# EAGLE schematic mcu_rev2_full (EAGLE 9.5.0)

## Sheet 1 of 2
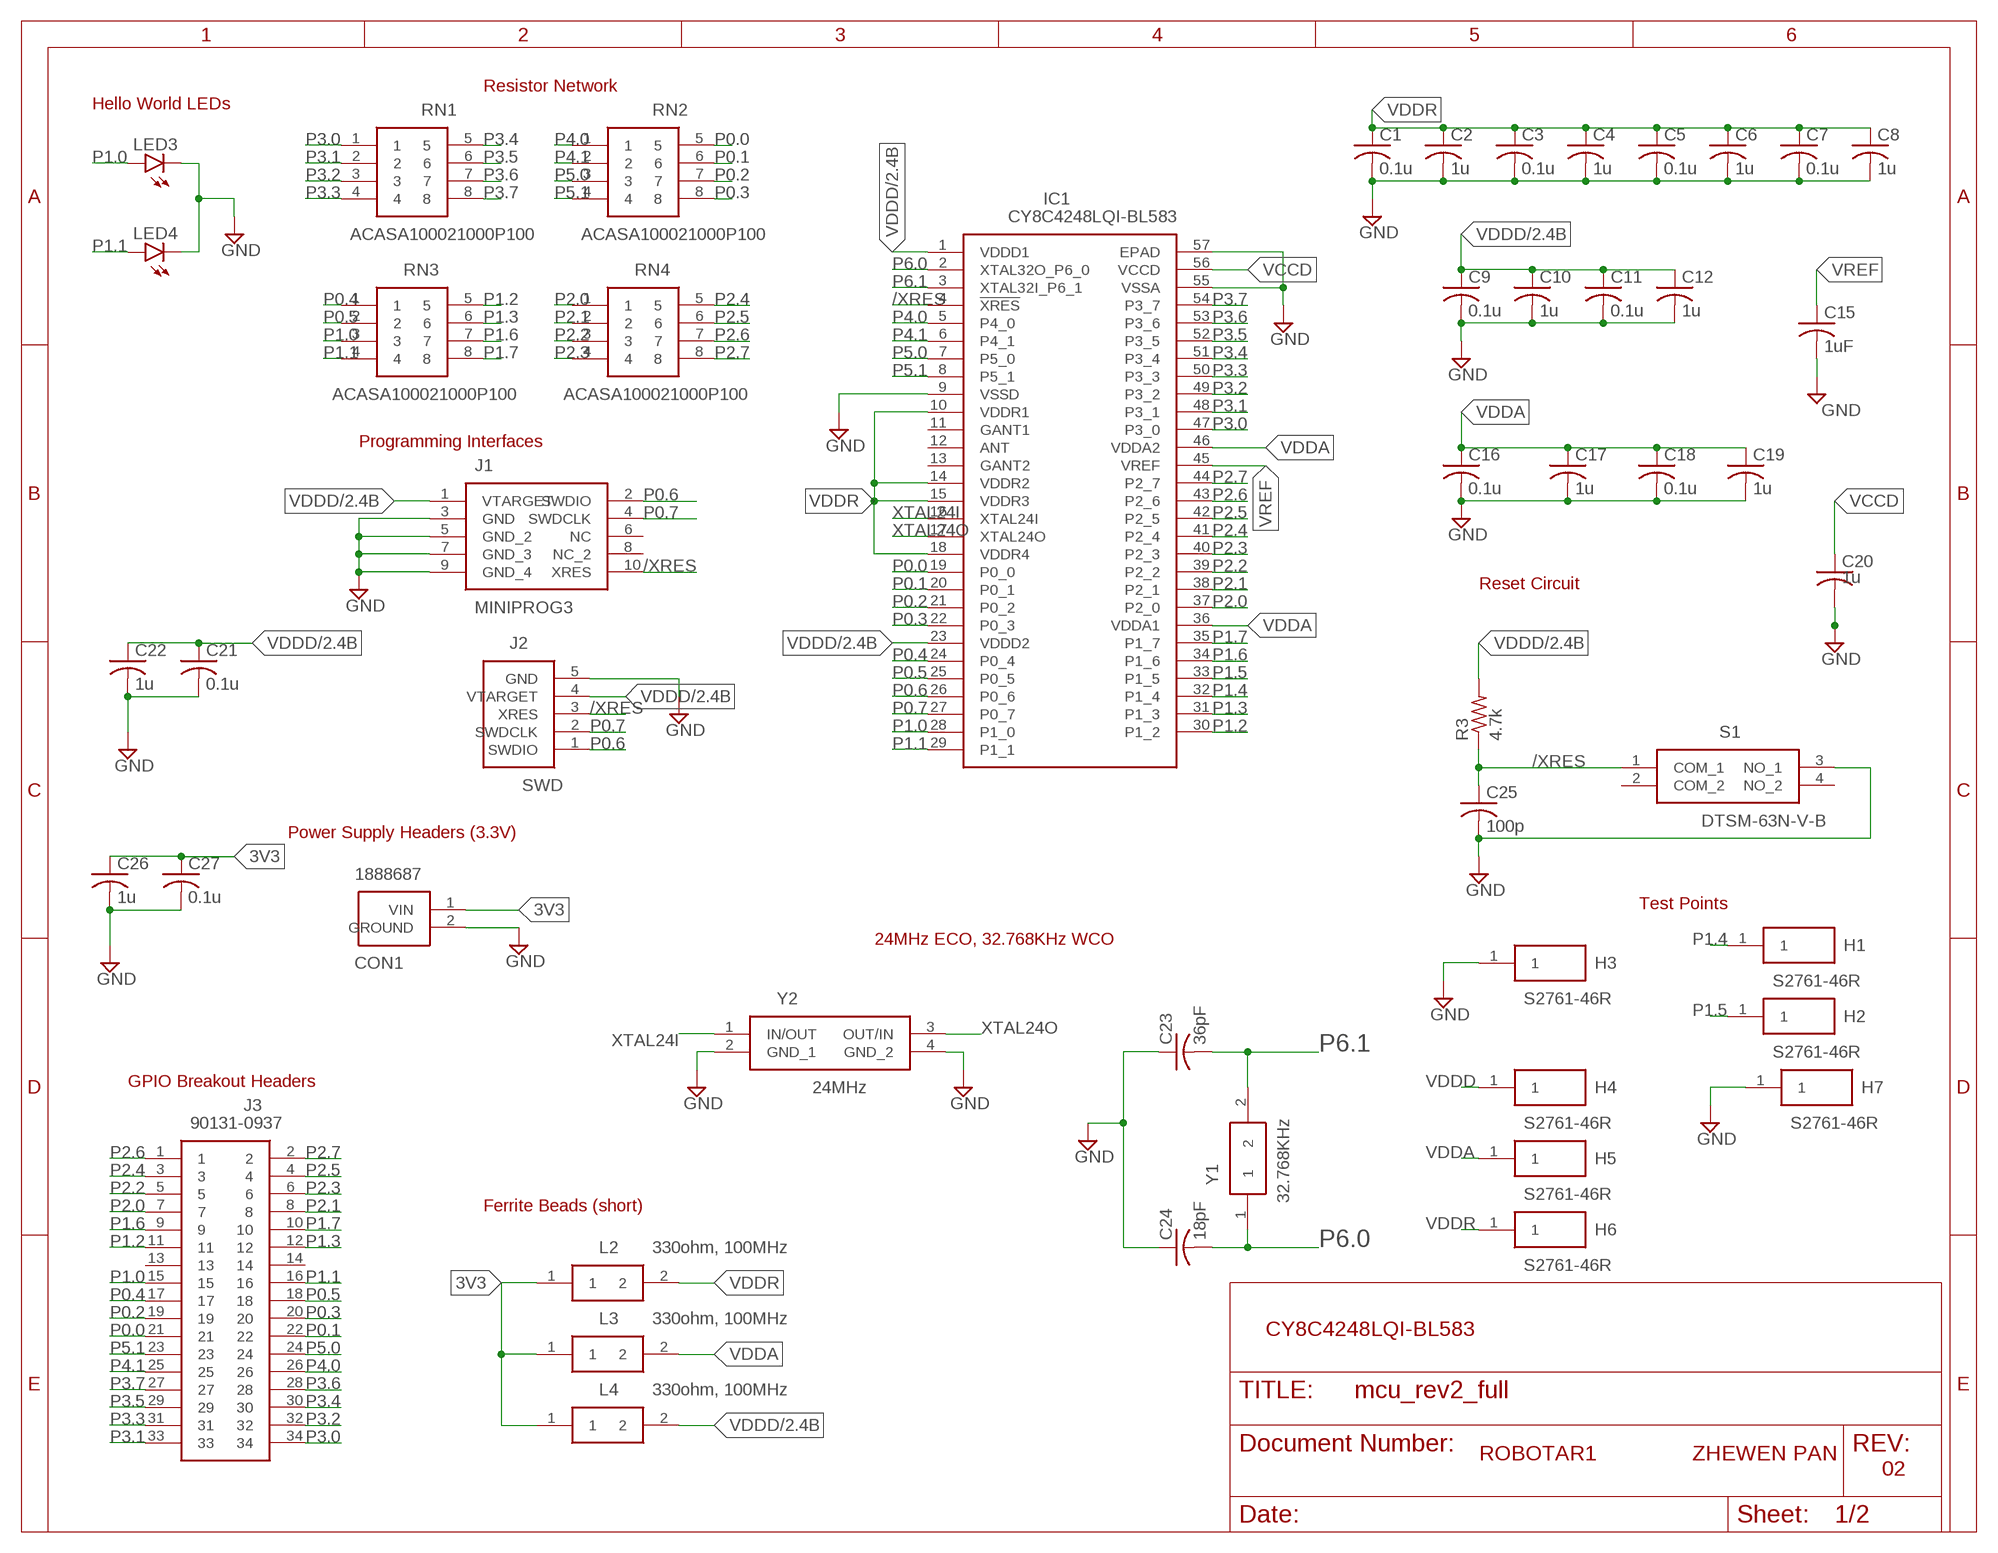
[diagram p0: schematic, sheet 1]

### Parts
C1  0.1u  C-USC0805  [C0805]
C2  1u  C-USC0805  [C0805]
C3  0.1u  C-USC0805  [C0805]
C4  1u  C-USC0805  [C0805]
C5  0.1u  C-USC0805  [C0805]
C6  1u  C-USC0805  [C0805]
C7  0.1u  C-USC0805  [C0805]
C8  1u  C-USC0805  [C0805]
C9  0.1u  C-USC0805  [C0805]
C10  1u  C-USC0805  [C0805]
C11  0.1u  C-USC0805  [C0805]
C12  1u  C-USC0805  [C0805]
C15  1uF  C-USC0805  [C0805]
C16  0.1u  C-USC0805  [C0805]
C17  1u  C-USC0805  [C0805]
C18  0.1u  C-USC0805  [C0805]
C19  1u  C-USC0805  [C0805]
C20  1u  C-USC0805  [C0805]
C21  0.1u  C-USC0805  [C0805]
C22  1u  C-USC0805  [C0805]
C23  36pF  C-USC0805  [C0805]
C24  18pF  C-USC0805  [C0805]
C25  100p  C-USC0805  [C0805]
C26  1u  C-USC0805  [C0805]
C27  0.1u  C-USC0805  [C0805]
CON1  1888687  [SHDR2W90P0X508_1X2_1016X950X15]
H1  S2761-46R  [S276146R]
H2  S2761-46R  [S276146R]
H3  S2761-46R  [S276146R]
H4  S2761-46R  [S276146R]
H5  S2761-46R  [S276146R]
H6  S2761-46R  [S276146R]
H7  S2761-46R  [S276146R]
IC1  CY8C4248LQI-BL583  [QFN40P700X700X60-57N]
J1  MINIPROG3  FTSH-105-01-L-DV-K  [FTSH-105-01-L-DV-K]
J2  SWD  22-23-2051  [HDRV5W64P0X254_1X5_1255X635X81]
J3  90131-0937  [HDRV34W90P254_2X17_4308X500X56]
L2  330ohm, 100MHz  BLM21PG331SN1D  [BEADC2012X105N]
L3  330ohm, 100MHz  BLM21PG331SN1D  [BEADC2012X105N]
L4  330ohm, 100MHz  BLM21PG331SN1D  [BEADC2012X105N]
LED3  LEDSML0805  [SML0805]
LED4  LEDSML0805  [SML0805]
R3  4.7k  R-US_R0805  [R0805]
RN1  ACASA100021000P100  [ACASA100021000P100]
RN2  ACASA100021000P100  [ACASA100021000P100]
RN3  ACASA100021000P100  [ACASA100021000P100]
RN4  ACASA100021000P100  [ACASA100021000P100]
S1  DTSM-63N-V-B  [DTSM63NVB]
Y1  32.768KHz  ECS-.327-12.5-34B-TR  [ECX-31B]
Y2  24MHz  ECS-240-8-36CKM-TR  [ECS240836QAESTR]

### Nets
3V3: C26.1 C27.1 CON1.1(VIN) L2.1 L3.1 L4.1
/XRES: C25.1 IC1.4(!XRES) J1.10(XRES) J2.3(XRES) R3.1 S1.1(COM_1)
GND: C1.2 C2.2 C3.2 C4.2 C5.2 C6.2 C7.2 C8.2 C9.2 C10.2 C11.2 C12.2 C15.2 C16.2 C17.2 C18.2 C19.2 C20.2 C21.2 C22.2 C23.1 C24.1 C25.2 C26.2 C27.2 CON1.2(GROUND) H3.1 H7.1 IC1.9(VSSD) IC1.55(VSSA) IC1.57(EPAD) J1.3(GND) J1.5(GND_2) J1.7(GND_3) J1.9(GND_4) J2.5(GND) LED3.C LED4.C S1.3(NO_1) Y2.2(GND_1) Y2.4(GND_2) ; also sheet 2
P0.0: IC1.19(P0_0) J3.21 RN2.5
P0.1: IC1.20(P0_1) J3.22 RN2.6
P0.2: IC1.21(P0_2) J3.19 RN2.7
P0.3: IC1.22(P0_3) J3.20 RN2.8
P0.4: IC1.24(P0_4) J3.17 RN3.1
P0.5: IC1.25(P0_5) J3.18 RN3.2
P0.6: IC1.26(P0_6) J1.2(SWDIO) J2.1(SWDIO)
P0.7: IC1.27(P0_7) J1.4(SWDCLK) J2.2(SWDCLK)
P1.0: IC1.28(P1_0) J3.15 LED3.A RN3.3
P1.1: IC1.29(P1_1) J3.16 LED4.A RN3.4
P1.2: IC1.30(P1_2) J3.11 RN3.5
P1.3: IC1.31(P1_3) J3.12 RN3.6
P1.4: H1.1 IC1.32(P1_4) ; also sheet 2
P1.5: H2.1 IC1.33(P1_5) ; also sheet 2
P1.6: IC1.34(P1_6) J3.9 RN3.7 ; also sheet 2
P1.7: IC1.35(P1_7) J3.10 RN3.8
P2.0: IC1.37(P2_0) J3.7 RN4.1
P2.1: IC1.38(P2_1) J3.8 RN4.2
P2.2: IC1.39(P2_2) J3.5 RN4.3
P2.3: IC1.40(P2_3) J3.6 RN4.4
P2.4: IC1.41(P2_4) J3.3 RN4.5
P2.5: IC1.42(P2_5) J3.4 RN4.6
P2.6: IC1.43(P2_6) J3.1 RN4.7
P2.7: IC1.44(P2_7) J3.2 RN4.8
P3.0: IC1.47(P3_0) J3.34 RN1.1
P3.1: IC1.48(P3_1) J3.33 RN1.2
P3.2: IC1.49(P3_2) J3.32 RN1.3
P3.3: IC1.50(P3_3) J3.31 RN1.4
P3.4: IC1.51(P3_4) J3.30 RN1.5
P3.5: IC1.52(P3_5) J3.29 RN1.6
P3.6: IC1.53(P3_6) J3.28 RN1.7
P3.7: IC1.54(P3_7) J3.27 RN1.8
P4.0: IC1.5(P4_0) J3.26 RN2.1
P4.1: IC1.6(P4_1) J3.25 RN2.2
P5.0: IC1.7(P5_0) J3.24 RN2.3
P5.1: IC1.8(P5_1) J3.23 RN2.4
P6.0: C24.2 IC1.2(XTAL32O_P6_0) Y1.1
P6.1: C23.2 IC1.3(XTAL32I_P6_1) Y1.2
VCCD: C20.1 IC1.56(VCCD)
VDDA: C16.1 C17.1 C18.1 C19.1 H5.1 IC1.36(VDDA1) IC1.46(VDDA2) L3.2
VDDD: C9.1 C10.1 C11.1 C12.1 C21.1 C22.1 H4.1 IC1.1(VDDD1) IC1.23(VDDD2) J1.1(VTARGET) J2.4(VTARGET) L4.2 R3.2 ; also sheet 2
VDDR: C1.1 C2.1 C3.1 C4.1 C5.1 C6.1 C7.1 C8.1 H6.1 IC1.10(VDDR1) IC1.14(VDDR2) IC1.15(VDDR3) IC1.18(VDDR4) L2.2
VREF: C15.1 IC1.45(VREF)
XTAL24I: IC1.16(XTAL24I) Y2.1(IN/OUT)
XTAL24O: IC1.17(XTAL24O) Y2.3(OUT/IN)
Unconnected: IC1.11(GANT1) IC1.12(ANT) IC1.13(GANT2) J1.6(NC) J1.8(NC_2) J3.13 J3.14 S1.2(COM_2) S1.4(NO_2)

### Notes on the sheet
- Resistor Network
- Hello World LEDs
- Programming Interfaces
- Reset Circuit
- Power Supply Headers (3.3V)
- Test Points
- 24MHz ECO, 32.768KHz WCO
- GPIO Breakout Headers
- Ferrite Beads (short)
- CY8C4248LQI-BL583
- ROBOTAR1 | ZHEWEN PAN | 02

## Sheet 2 of 2
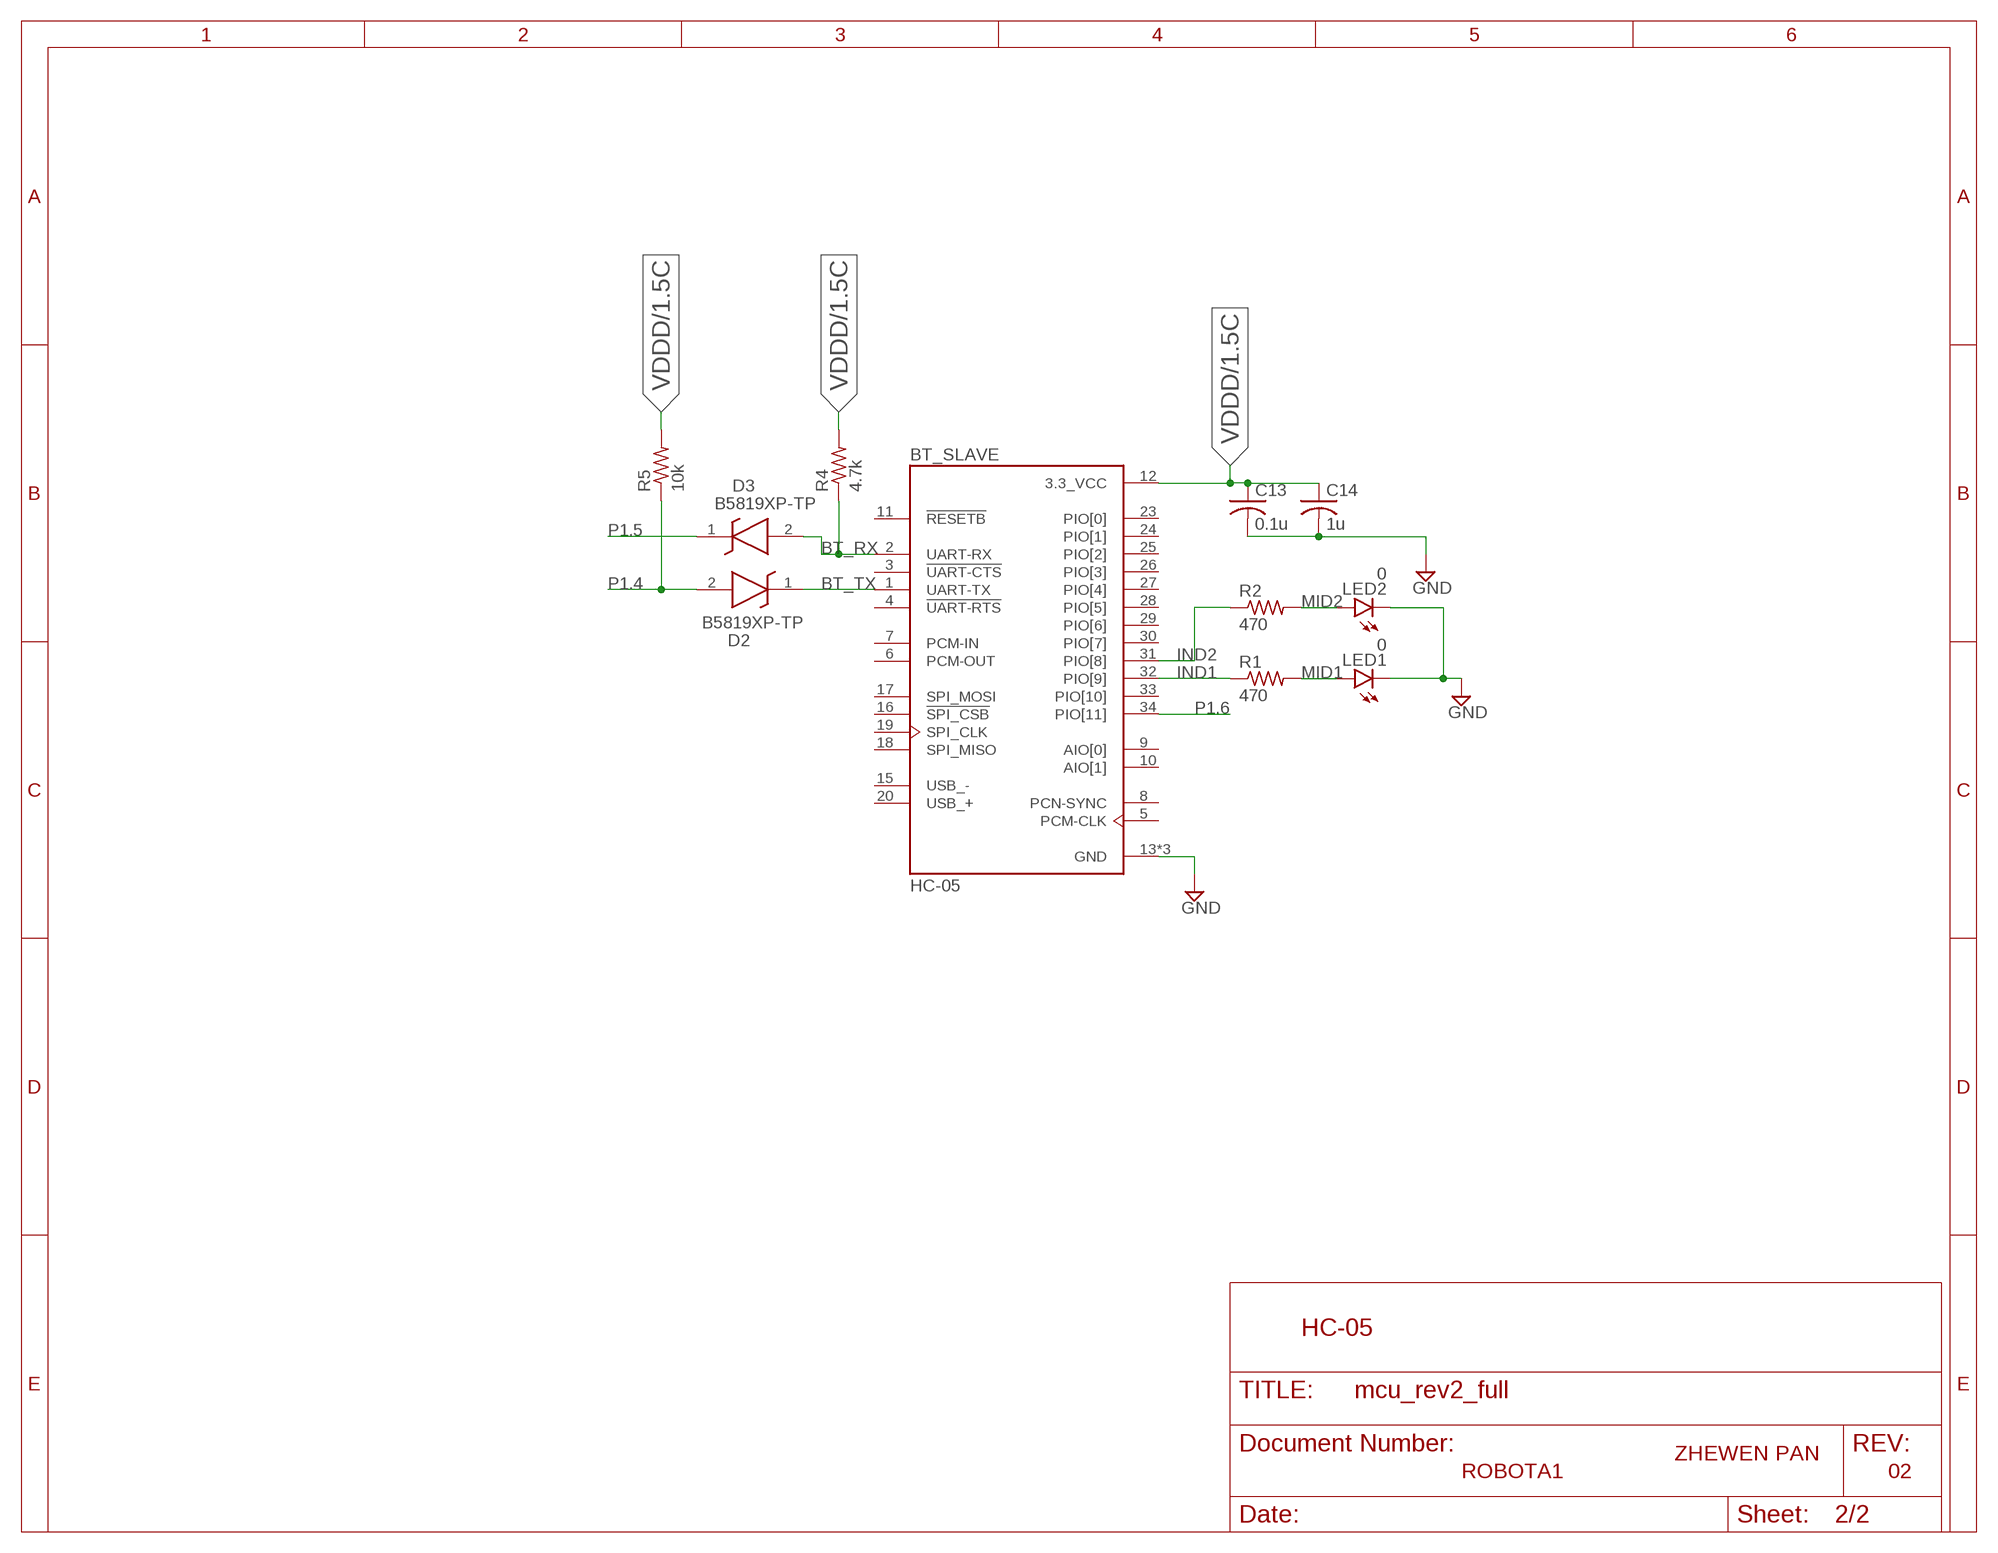
[diagram p1: schematic, sheet 2]

### Parts
BT_SLAVE  HC-05  [XCVR_HC-05]
C13  0.1u  C-USC0805  [C0805]
C14  1u  C-USC0805  [C0805]
D2  B5819XP-TP  [B5819XPTP]
D3  B5819XP-TP  [B5819XPTP]
LED1  0  LEDSML0805  [SML0805]
LED2  0  LEDSML0805  [SML0805]
R1  470  R-US_R0805  [R0805]
R2  470  R-US_R0805  [R0805]
R4  4.7k  R-US_R0805  [R0805]
R5  10k  R-US_R0805  [R0805]

### Nets
BT_RX: BT_SLAVE.2(UART-RX) D3.2(+) R4.1
BT_TX: BT_SLAVE.1(UART-TX) D2.1(-)
GND: BT_SLAVE.13(GND) BT_SLAVE.21(GND) BT_SLAVE.22(GND) C13.2 C14.2 LED1.C LED2.C ; also sheet 1
IND1: BT_SLAVE.32(PIO[9]) R1.1
IND2: BT_SLAVE.31(PIO[8]) R2.1
MID1: LED1.A R1.2
MID2: LED2.A R2.2
P1.4: D2.2(+) R5.1 ; also sheet 1
P1.5: D3.1(-) ; also sheet 1
P1.6: BT_SLAVE.34(PIO[11]) ; also sheet 1
VDDD: BT_SLAVE.12(3.3_VCC) C13.1 C14.1 R4.2 R5.2 ; also sheet 1
Unconnected: BT_SLAVE.3(!UART-CTS) BT_SLAVE.4(!UART-RTS) BT_SLAVE.5(PCM-CLK) BT_SLAVE.6(PCM-OUT) BT_SLAVE.7(PCM-IN) BT_SLAVE.8(PCN-SYNC) BT_SLAVE.9(AIO[0]) BT_SLAVE.10(AIO[1]) BT_SLAVE.11(!RESETB) BT_SLAVE.15(USB_-) BT_SLAVE.16(!SPI_CSB) BT_SLAVE.17(SPI_MOSI) BT_SLAVE.18(SPI_MISO) BT_SLAVE.19(SPI_CLK) BT_SLAVE.20(USB_+) BT_SLAVE.23(PIO[0]) BT_SLAVE.24(PIO[1]) BT_SLAVE.25(PIO[2]) BT_SLAVE.26(PIO[3]) BT_SLAVE.27(PIO[4]) BT_SLAVE.28(PIO[5]) BT_SLAVE.29(PIO[6]) BT_SLAVE.30(PIO[7]) BT_SLAVE.33(PIO[10])

### Notes on the sheet
- HC-05
- ZHEWEN PAN
- ROBOTA1 | 02

## Library data of the parts
BT_SLAVE = HC-05:HC-05: Bluetooth to Serial Port Module; AVAILABILITY: Unavailable; MF: Texas Instruments; MP: HC-05; PACKAGE: SOIC-14; PRICE: None; SPICEPREFIX: X
C1-C27 = rcl:C-US: CAPACITOR, American symbol; SPICEPREFIX: C
CON1 = SamacSys_Parts:1888687: Phoenix Contact COMBICON MKDSN Series 5.08mm Pitch Straight PCB Terminal Block with Screw Termination, Through Hole Source: Datasheet <http://uk.rs-online.com/web/p/products/8045095>; ALLIED_NUMBER: 70054422; DESCRIPTION: Phoenix Contact COMBICON MKDSN Series 5.08mm Pitch Straight PCB Terminal Block with Screw Termination, Through Hole; HEIGHT: 15mm; MANUFACTURER_NAME: Phoenix Contact; MANUFACTURER_PART_NUMBER: 1888687; RS_PART_NUMBER: 8045095; RS_PRICE-STOCK: http://uk.rs-online.com/web/p/products/8045095
D2 D3 = SamacSys_Parts:B5819XP-TP: Schottky Diodes & Rectifiers 1A,40V,Schottky,FBP-02L Package Source: Datasheet <http://www.mccsemi.com/up_pdf/B5819XP(FBP-02L)-B.pdf>; DESCRIPTION: Schottky Diodes & Rectifiers 1A,40V,Schottky,FBP-02L Package; HEIGHT: 0.55mm; MANUFACTURER_NAME: Micro Commercial Components (MCC); MANUFACTURER_PART_NUMBER: B5819XP-TP
H1-H7 = S2761-46R:S2761-46R: Circuit Board Hardware - PCB SMT Mini Test Terminal, Reel Source: Datasheet <https://cdn.harwin.com/pdfs/S2761R.pdf>; DESCRIPTION: Circuit Board Hardware - PCB SMT Mini Test Terminal, Reel; HEIGHT: 1.15mm; MANUFACTURER_NAME: HARWIN; MANUFACTURER_PART_NUMBER: S2761-46R
IC1 = CY8C4248LQI-BL583:CY8C4248LQI-BL583: PSoC 4xx8_BLE Source: Datasheet <http://uk.rs-online.com/web/p/products/1771220P>; DESCRIPTION: PSoC 4xx8_BLE; HEIGHT: mm; MANUFACTURER_NAME: Cypress Semiconductor; MANUFACTURER_PART_NUMBER: CY8C4248LQI-BL583; RS_PART_NUMBER: 1771220P; RS_PRICE-STOCK: http://uk.rs-online.com/web/p/products/1771220P
J1 = SamacSys_Parts:FTSH-105-01-L-DV-K: SMT Micro Header, 10 position, 2-row Source: Datasheet <http://suddendocs.samtec.com/catalog_english/ftsh_smt.pdf>; DESCRIPTION: SMT Micro Header, 10 position, 2-row; HEIGHT: mm; MANUFACTURER_NAME: SAMTEC; MANUFACTURER_PART_NUMBER: FTSH-105-01-L-DV-K; RS_PART_NUMBER: 1592332; RS_PRICE-STOCK: https://uk.rs-online.com/web/p/products/1592332
J2 = SamacSys_Parts:22-23-2051: Headers & Wire Housings VERT PCB HDR 5P TIN FRICTION LOCK Source: Datasheet <http://uk.rs-online.com/web/p/products/1888757>; ALLIED_NUMBER: 70190811; DESCRIPTION: Headers & Wire Housings VERT PCB HDR 5P TIN FRICTION LOCK; HEIGHT: 8.18mm; MANUFACTURER_NAME: Molex; MANUFACTURER_PART_NUMBER: 22-23-2051; RS_PART_NUMBER: 1888757; RS_PRICE-STOCK: http://uk.rs-online.com/web/p/products/1888757
J3 = 90131-0937:90131-0937: Molex C-GRID III Series, Series Number 90131, 2.54mm Pitch 34 Way 2 Row Straight PCB Header, Solder Termination, 3A Source: Datasheet <http://uk.rs-online.com/web/p/products/6703569>; ALLIED_NUMBER: 70373750; DESCRIPTION: Molex C-GRID III Series, Series Number 90131, 2.54mm Pitch 34 Way 2 Row Straight PCB Header, Solder Termination, 3A; HEIGHT: 5.6mm; MANUFACTURER_NAME: Molex; MANUFACTURER_PART_NUMBER: 90131-0937; RS_PART_NUMBER: 6703569; RS_PRICE-STOCK: http://uk.rs-online.com/web/p/products/6703569
L2-L4 = BLM21PG331SN1D:BLM21PG331SN1D: Ferrite bead 0805 SMD 330R 1.5A Ferrite bead 0805 SMD 330R 1.5A Source: Datasheet <http://uk.rs-online.com/web/p/products/7241545P>; DESCRIPTION: Ferrite bead 0805 SMD 330R 1.5A Ferrite bead 0805 SMD 330R 1.5A; HEIGHT: 1.05mm; MANUFACTURER_NAME: Murata Electronics; MANUFACTURER_PART_NUMBER: BLM21PG331SN1D; RS_PART_NUMBER: 7241545P; RS_PRICE-STOCK: http://uk.rs-online.com/web/p/products/7241545P
LED1-LED4 = led:LED: LED OSRAM: - CHIPLED LG R971, LG N971, LY N971, LG Q971, LY Q971, LO R971, LY R971 LH N974, LH R974 LS Q976, LO Q976, LY Q976 LO Q996 - Hyper CHIPLED LW Q18S LB Q993, LB Q99A, LB R99A - SideLED LS A670, LO A670, LY A670, LG A670, LP A670 LB A673, LV A673, LT A673, LW A673 LH A674 LY A675 LS A676, LA A676, LO A676, LY A676, LW A676 LS A679, LY A679, LG A679 - Hyper Micro SIDELED® LS Y876, LA Y876, LO Y876, LY Y876 LT Y87S - SmartLED LW L88C, LW L88S LB L89C, LB L89S, LG L890 LS L89K, LO L89K, LY L89K LS L896, LA L896, LO L896, LY L896 - TOPLED LS T670, LO T670, LY T670, LG T670, LP T670 LSG T670, LSP T670, LSY T670, LOP T670, LYG T670 LG T671, LOG T671, LSG T671 LB T673, LV T673, LT T673, LW T673 LH T674 LS T676, LA T676, LO T676, LY T676, LB T676, LH T676, LSB T676, LW T676 LB T67C, LV T67C, LT T67C, LS T67K, LO T67K, LY T67K, LW E67C LS E67B, LA E67B, LO E67B, LY E67B, LB E67C, LV E67C, LT E67C LW T67C LS T679, LY T679, LG T679 LS T770, LO T770, LY T770, LG T770, LP T770 LB T773, LV T773, LT T773, LW T773 LH T774 LS E675, LA E675, LY E675, LS T675 LS T776, LA T776, LO T776, LY T776, LB T776 LHGB T686 LT T68C, LB T68C - Hyper Mini TOPLED® LB M676 - Mini TOPLED Santana® LG M470 LS M47K, LO M47K, LY M47K Source: http://www.osram.convergy.de LUXEON: - LUMILED® LXK2-PW12-R00, LXK2-PW12-S00, LXK2-PW14-U00, LXK2-PW14-V00 LXK2-PM12-R00, LXK2-PM12-S00, LXK2-PM14-U00 LXK2-PE12-Q00, LXK2-PE12-R00, LXK2-PE12-S00, LXK2-PE14-T00, LXK2-PE14-U00 LXK2-PB12-K00, LXK2-PB12-L00, LXK2-PB12-M00, LXK2-PB14-N00, LXK2-PB14-P00, LXK2-PB14-Q00 LXK2-PR12-L00, LXK2-PR12-M00, LXK2-PR14-Q00, LXK2-PR14-R00 LXK2-PD12-Q00, LXK2-PD12-R00, LXK2-PD12-S00 LXK2-PH12-R00, LXK2-PH12-S00 LXK2-PL12-P00, LXK2-PL12-Q00, LXK2-PL12-R00 Source: www.luxeon.com KINGBRIGHT: KA-3528ASYC Source: www.kingbright.com
R1-R5 = rcl:R-US_: RESISTOR, American symbol; SPICEPREFIX: R
RN1-RN4 = ACASA100021000P100:ACASA100021000P100: Vishay ACAS 0612 - Professional Series 100 +/-0.5% Isolated SMT Resistor Array, 4 Resistors, 0.3W total Source: Datasheet <http://uk.rs-online.com/web/p/products/6845742P>; ALLIED_NUMBER: 70398241; DESCRIPTION: Vishay ACAS 0612 - Professional Series 100 +/-0.5% Isolated SMT Resistor Array, 4 Resistors, 0.3W total; HEIGHT: 0mm; MANUFACTURER_NAME: Vishay; MANUFACTURER_PART_NUMBER: ACASA100021000P100; RS_PART_NUMBER: 6845742P; RS_PRICE-STOCK: http://uk.rs-online.com/web/p/products/6845742P
S1 = push_button:DTSM-63N-V-B: Tactile Switches Surface Mounting Type 6*6 Source: Datasheet <http://www.dip.com.tw/en/en-product-information/en-switch004/item/download/2502_92b64433b455dc19d9198989b26071be>; DESCRIPTION: Tactile Switches Surface Mounting Type 6*6; HEIGHT: 7.1mm; MANUFACTURER_NAME: Diptronics; MANUFACTURER_PART_NUMBER: DTSM-63N-V-B
Y1 = SamacSys_Parts:ECS-.327-12.5-34B-TR: Crystals 32.768KHz 20ppm 12.5pF -40C +85C Source: Datasheet; DESCRIPTION: Crystals 32.768KHz 20ppm 12.5pF -40C +85C; HEIGHT: mm; MANUFACTURER_NAME: ECS; MANUFACTURER_PART_NUMBER: ECS-.327-12.5-34B-TR
Y2 = SamacSys_Parts:ECS-240-8-36CKM-TR: Crystals 24MHz 10ppm Source: Datasheet; DESCRIPTION: Crystals 24MHz 10ppm; HEIGHT: 0mm; MANUFACTURER_NAME: ECS; MANUFACTURER_PART_NUMBER: ECS-240-8-36CKM-TR; SPICEPREFIX: E